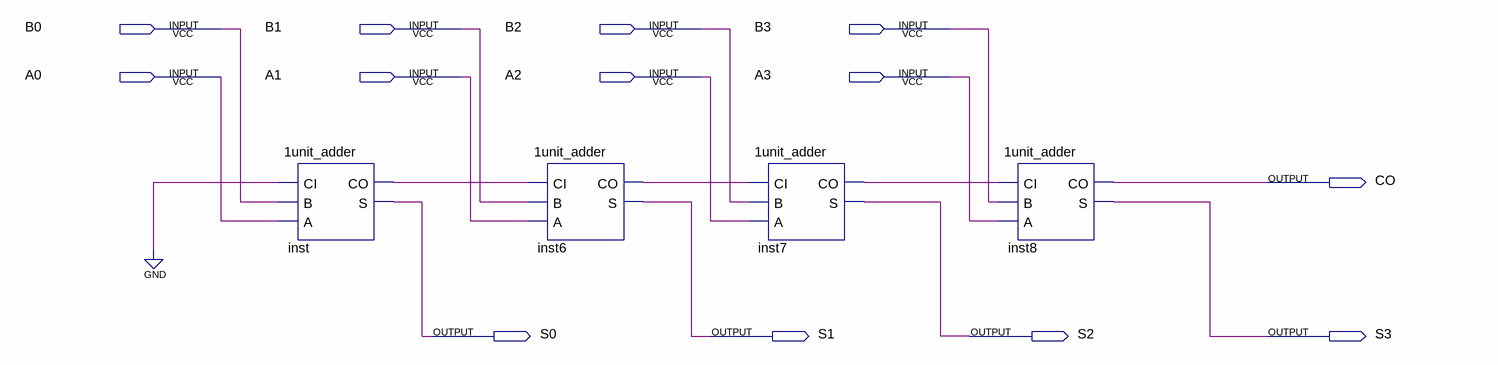
[diagram p0: schematic sheet]
// Quartus schematic 4unit_adder.bdf as structural Verilog: 4 symbols, 13 pins
module \4unit_adder  (
  input  B0,
  input  B1,
  input  B2,
  input  B3,
  input  A0,
  input  A1,
  input  A2,
  input  A3,
  output CO,
  output S0,
  output S1,
  output S2,
  output S3
);

  wire inst6_co, inst7_co, inst_co;

  \1unit_adder  inst (.CI(1'b0), .B(B0), .A(A0), .CO(inst_co), .S(S0));
  \1unit_adder  inst6 (.CI(inst_co), .B(B1), .A(A1), .CO(inst6_co), .S(S1));
  \1unit_adder  inst7 (.CI(inst6_co), .B(B2), .A(A2), .CO(inst7_co), .S(S2));
  \1unit_adder  inst8 (.CI(inst7_co), .B(B3), .A(A3), .CO(CO), .S(S3));
endmodule
